# Altium project TestBoard.PrjPcb
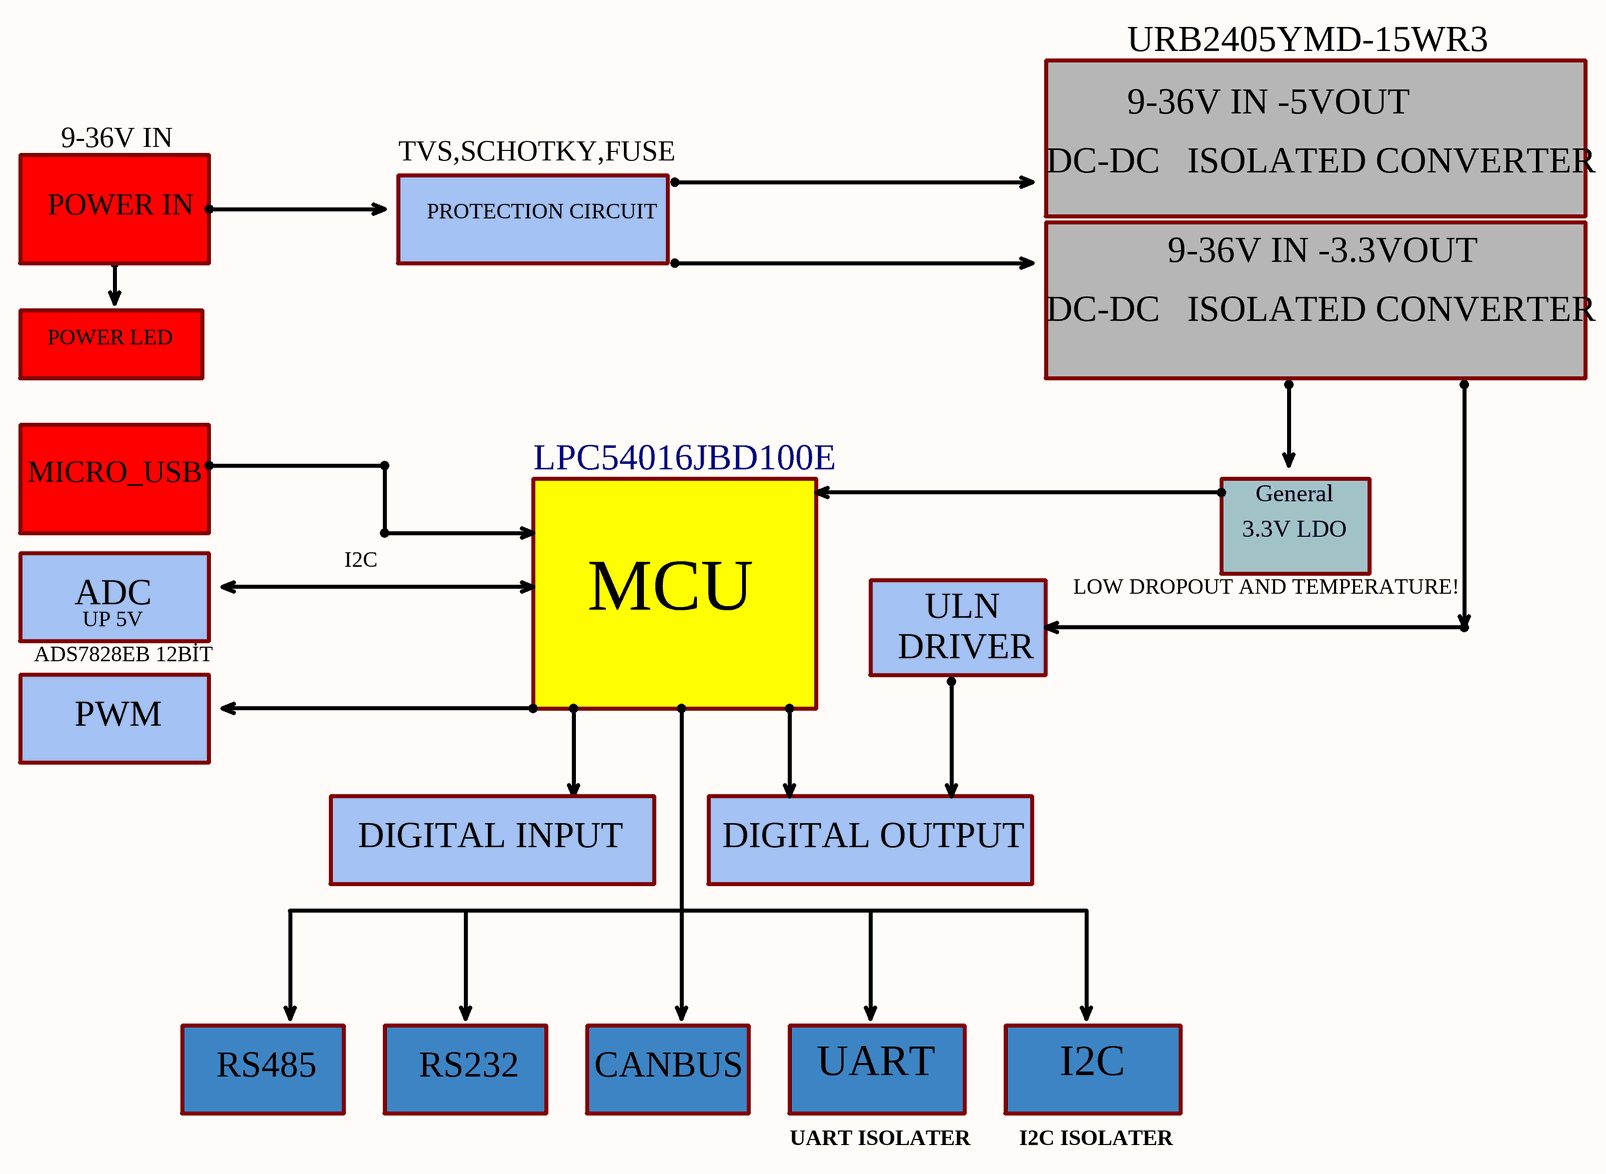
[diagram p0: Blockdiagram.SchDoc]
4 sheets, 61 parts. Net scope: flat (ports and power ports of the same name join across sheets).
Sheets:
  Blockdiagram.SchDoc
  CPU.SchDoc
  communication.SchDoc
  USER_IO.SchDoc

## Sheet Blockdiagram.SchDoc
size A3

### Notes on the sheet
- URB2405YMD-15WR3
- 9-36V IN
- 9-36V IN -5VOUT
- POWER IN
- TVS,SCHOTKY,FUSE
- PROTECTION CIRCUIT
- DC-DC   ISOLATED CONVERTER
- 9-36V IN -3.3VOUT
- POWER LED
- MICRO_USB
- LPC54016JBD100E
- 3.3V LDO
- General
- ADC
- UP 5V
- I2C
- MCU
- ULN
- LOW DROPOUT AND TEMPERATURE!
- ADS7828EB 12BİT
- DRIVER
- PWM
- DIGITAL INPUT
- DIGITAL OUTPUT
- RS485
- RS232
- CANBUS
- UART
- UART ISOLATER
- I2C ISOLATER

## Sheet CPU.SchDoc
size A3
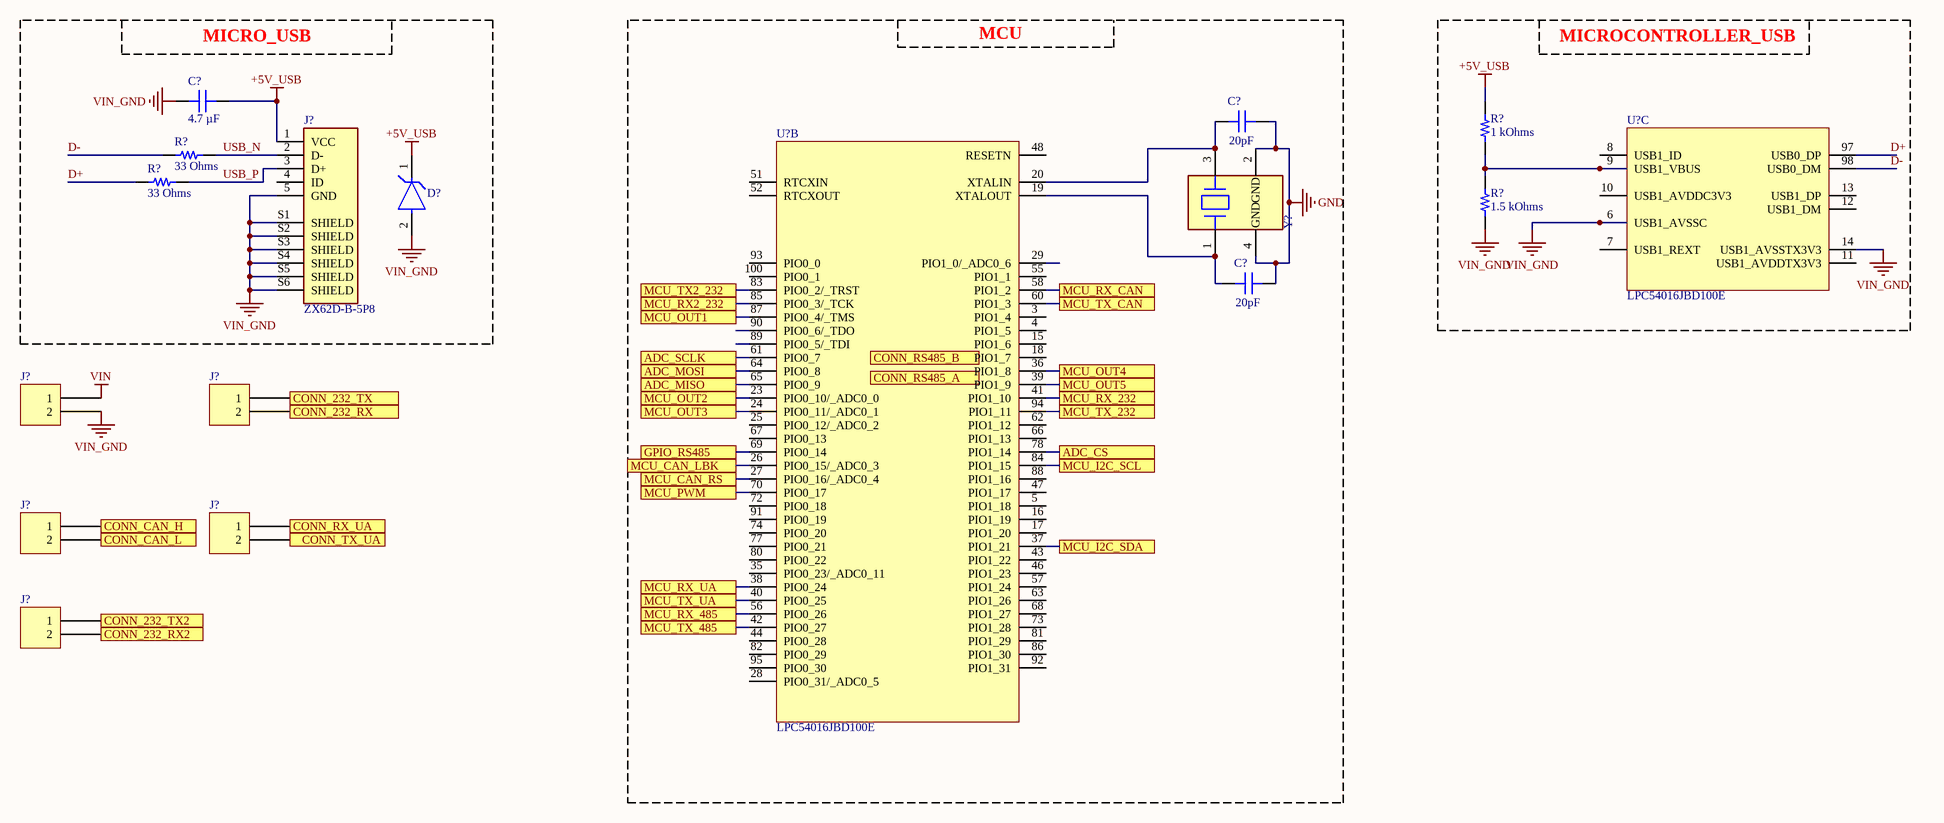
[diagram p1: CPU.SchDoc]

### Parts
(Parts that share a designator on the sheet are numbered #1, #2 ... from top to bottom, then left to right.)
C?#1  4.7 µF  [CAP 0603_1608]
C?#2  20pF  [CAP 0603_1608]
C?#3  20pF  [CAP 0603_1608]
D?  ESDA7P60-1U1M  [TVS-1610]  (value not drawn)
J?#1  ZX62D-B-5P8  [HRS_ZX62D-B-5P8]
J?#2  282834-2  [TE 282834-2]  (value not drawn)
J?#3  282834-2  [TE 282834-2]  (value not drawn)
J?#4  282834-2  [TE 282834-2]  (value not drawn)
J?#5  282834-2  [TE 282834-2]  (value not drawn)
J?#6  282834-2  [TE 282834-2]  (value not drawn)
R?#1  1 kOhms  [RES 0603_1608]
R?#2  33 Ohms  [RES 0603_1608]
R?#3  33 Ohms  [RES 0603_1608]
R?#4  1.5 kOhms  [RES 0603_1608]
U?#1  LPC54016JBD100E  [LQFP-100]  (part C of 3)
U?#2  LPC54016JBD100E  [LQFP-100]  (part B of 3)
Y?  8Z-12.000MAAJ-T  [TXC_8Z_MFG]  (value not drawn)

### Blocks framed on the sheet
MICRO_USB: C?#1 D? J?#1 R?#2 R?#3
MCU: C?#2 C?#3 U?#2 Y?
MICROCONTROLLER_USB: R?#1 R?#4 U?#1

### Ports
ADC_CS, ADC_MISO, ADC_MOSI, ADC_SCLK, CONN_232_RX, CONN_232_RX2, CONN_232_TX, CONN_232_TX2, CONN_CAN_H, CONN_CAN_L, CONN_RS485_A, CONN_RS485_B, CONN_RX_UA, CONN_TX_UA, GPIO_RS485, MCU_CAN_LBK, MCU_CAN_RS, MCU_I2C_SCL, MCU_I2C_SDA, MCU_OUT1, MCU_OUT2, MCU_OUT3, MCU_OUT4, MCU_OUT5, MCU_PWM, MCU_RX2_232, MCU_RX_232, MCU_RX_485, MCU_RX_CAN, MCU_RX_UA, MCU_TX2_232, MCU_TX_232, MCU_TX_485, MCU_TX_CAN, MCU_TX_UA

### Nets
+5V_USB: C?#1.2 D?.1(C) J?#1.1(VCC) R?#1.2
GND: C?#2.2 C?#3.2 Y?.2(GND) Y?.4(GND)
VIN: J?#2.1
VIN_GND: C?#1.1 D?.2(A) J?#1.5(GND) J?#1.S1(SHIELD) J?#1.S2(SHIELD) J?#1.S3(SHIELD) J?#1.S4(SHIELD) J?#1.S5(SHIELD) J?#1.S6(SHIELD) J?#2.2 R?#4.1 U?#1.6(USB1_AVSSC) U?#1.14(USB1_AVSSTX3V3)
CAN_H: J?#4.1 ; port CONN_CAN_H
CAN_L: J?#4.2 ; port CONN_CAN_L
CONN_RX_UA: J?#5.1 ; port CONN_RX_UA
CONN_TX_UA: J?#5.2 ; port CONN_TX_UA
D+: R?#3.1 U?#1.97(USB0_DP)
D-: R?#2.1 U?#1.98(USB0_DM)
GPIO_RS485: U?#2.69(PIO0_14) ; port GPIO_RS485
MCU_I2C_SCL: U?#2.84(PIO1_15) ; port MCU_I2C_SCL
MCU_I2C_SDA: U?#2.37(PIO1_21) ; port MCU_I2C_SDA
MCU_RX_485: U?#2.56(PIO0_26) ; port MCU_RX_485
MCU_RX_CAN: U?#2.58(PIO1_2) ; port MCU_RX_CAN
MCU_RX_UA: U?#2.38(PIO0_24) ; port MCU_RX_UA
MCU_TX_485: U?#2.42(PIO0_27) ; port MCU_TX_485
MCU_TX_CAN: U?#2.60(PIO1_3) ; port MCU_TX_CAN
MCU_TX_UA: U?#2.40(PIO0_25) ; port MCU_TX_UA
USB_N: J?#1.2(D-) R?#2.2
USB_P: J?#1.3(D+) R?#3.2
NetC?#2_1: C?#2.1 U?#2.20(XTALIN) Y?.3
NetC?#3_1: C?#3.1 U?#2.19(XTALOUT) Y?.1
NetJ?#3_1: J?#3.1 ; port CONN_232_TX
NetJ?#3_2: J?#3.2 ; port CONN_232_RX
NetJ?#6_1: J?#6.1 ; port CONN_232_TX2
NetJ?#6_2: J?#6.2 ; port CONN_232_RX2
NetQ?#1_1: U?#2.26(PIO0_15/_ADC0_3) ; port MCU_CAN_LBK
NetQ?#2_1: U?#2.27(PIO0_16/_ADC0_4) ; port MCU_CAN_RS
NetR?#1_1: R?#1.1 R?#4.2 U?#1.9(USB1_VBUS)
NetU?#2_23: U?#2.23(PIO0_10/_ADC0_0) ; port MCU_OUT2
NetU?#2_24: U?#2.24(PIO0_11/_ADC0_1) ; port MCU_OUT3
NetU?#2_36: U?#2.36(PIO1_8) ; port MCU_OUT4
NetU?#2_39: U?#2.39(PIO1_9) ; port MCU_OUT5
NetU?#2_41: U?#2.41(PIO1_10) ; port MCU_RX_232
NetU?#2_61: U?#2.61(PIO0_7) ; port ADC_SCLK
NetU?#2_64: U?#2.64(PIO0_8) ; port ADC_MOSI
NetU?#2_65: U?#2.65(PIO0_9) ; port ADC_MISO
NetU?#2_70: U?#2.70(PIO0_17) ; port MCU_PWM
NetU?#2_78: U?#2.78(PIO1_14) ; port ADC_CS
NetU?#2_83: U?#2.83(PIO0_2/_TRST) ; port MCU_TX2_232
NetU?#2_85: U?#2.85(PIO0_3/_TCK) ; port MCU_RX2_232
NetU?#2_87: U?#2.87(PIO0_4/_TMS) ; port MCU_OUT1
NetU?#2_94: U?#2.94(PIO1_11) ; port MCU_TX_232

Not connected (* = marked no-connect by the designer): J?#1 4(ID); U?#1 7(USB1_REXT) 8(USB1_ID) 10(USB1_AVDDC3V3) 11(USB1_AVDDTX3V3) 12(USB1_DM) 13(USB1_DP); U?#2 3(PIO1_4) 4(PIO1_5) 5(PIO1_18) 15(PIO1_6) 16(PIO1_19) 17(PIO1_20) 18(PIO1_7) 25(PIO0_12/_ADC0_2) 28(PIO0_31/_ADC0_5) 29(PIO1_0/_ADC0_6) 35(PIO0_23/_ADC0_11) 43(PIO1_22) 44(PIO0_28) 46(PIO1_23) 47(PIO1_17) 48(RESETN) 51(RTCXIN) 52(RTCXOUT) 55(PIO1_1) 57(PIO1_24) 62(PIO1_12) 63(PIO1_26) 66(PIO1_13) 67(PIO0_13) 68(PIO1_27) 72(PIO0_18) 73(PIO1_28) 74(PIO0_20) 77(PIO0_21) 80(PIO0_22) 81(PIO1_29) 82(PIO0_29) 86(PIO1_30) 88(PIO1_16) 89(PIO0_5/_TDI) 90(PIO0_6/_TDO) 91(PIO0_19) 92(PIO1_31) 93(PIO0_0) 95(PIO0_30) 100(PIO0_1)

### Library data of the parts
C?#1 = CL10A475KP8NNNC: CAP CER 4.7UF 10V X5R 0603; manufacturer: Samsung Electro-Mechanics; Tolerance: ±10%; Part Number: CL10A475KP8NNNC; Value: 4.7 µF; Applications: General Purpose; Capacitance: 4.7 µF; componentlink1description: Datasheet; componentlink1url: http://www.samsungsem.com/kr/support/product-search/mlcc/CL10A475KP8NNNC.jsp; componentlink2description: DigiKey Link; componentlink2url: https://www.digikey.com/en/products/detail/samsung-electro-mechanics/CL10A475KP8NNNC/3886702; Device Package: 0603 (1608 Metric); lastupdated: 12.04.2022 22:08:21; Lifecycle Status: Active; Minimum Order: 1; Mounting Type: Surface Mount, MLCC; Operating Temperature: -55°C ~ 85°C; Package / Case: 0603 (1608 Metric); packaging: TapeAndReel; partid: 5671; Part Status: Active; price: 0.01; series: CL; Size / Dimension: 0.063" L x 0.031" W (1.60mm x 0.80mm); Supplier 1: DigiKey; Supplier Part Number 1: 1276-1044-1-ND; Temperature Coefficient: X5R; Thickness (Max): 0.035" (0.90mm); Voltage - Rated: 10V
C?#2 C?#3 = 06035A200JAT2A: CAP CER 20PF 50V C0G/NP0 0603; manufacturer: AVX Corporation; Temperature Coefficient: C0G, NP0; Tolerance: ±5%; Part Number: 06035A200JAT2A; Value: 20pF; Applications: General Purpose; Capacitance: 20pF; componentlink1description: Datasheet; componentlink1url: http://datasheets.avx.com/C0GNP0-Dielectric.pdf; componentlink2description: DigiKey Link; componentlink2url: http://digikey.com/product-detail/en/avx-corporation/06035A200JAT2A/478-7912-1-ND/3881535; Device Package: 0603 (1608 Metric); lastupdated: 2.09.2020 01:03:27; Lifecycle Status: Active; Minimum Order: 1; Mounting Type: Surface Mount, MLCC; Operating Temperature: -55°C ~ 125°C; Package / Case: 0603 (1608 Metric); packaging: TapeAndReel; partid: 7153; Part Status: Active; price: 0.04; series: -; Size / Dimension: 0.063" L x 0.032" W (1.60mm x 0.81mm); Supplier 1: DigiKey; Supplier Part Number 1: 478-7912-1-ND; Thickness (Max): 0.035" (0.90mm); Voltage - Rated: 50V
D? = ESDA7P60-1U1M: ESDA Series 6.4 V 700 W SMT Uni-Directional TVS Diode - 1610; Manufacturer: STMicroelectronics; Number of Unidirectional Channels: 1; Reverse Standoff Voltage: 5V; Min Breakdown Voltage: 6.4V; Clamping Voltage: 11.6V; Peak Pulse Power: 700W; Power Line Protection: No; Polarity: Unidirectional; Max Breakdown Voltage: 7.2V; Peak Pulse Current: 60A; Supplier 1: Digi-Key; Manufacturer Part Number: ESDA7P60-1U1M; RoHS: Yes; Category: TVS Diodes; Stock 1: 12994; Pricing 1: 1=0,51000, 10=0,38400, 100=0,23910, 500=0,16360, 1000=0,12584, 2000=0,11326 (USD); Mount: Surface Mount; Case/Package: 1610; Number of Pins: 2; Min Operating Temperature: -55°C; Max Operating Temperature: 150°C; Packaging: Cut Tape; Resistor Type: Zener; REACH SVHC: No SVHC; RoHS Compliant: Yes; ComponentLink1URL: http://www.farnell.com/datasheets/2041290.pdf?src-supplier=Farnell; ComponentLink1Description: http://www.farnell.com/datasheets/2041290.pdf?src-supplier=Farnell; ComponentLink2URL: http://www.st.com/content/ccc/resource/technical/document/datasheet/44/e9/26/44/42/ee/4f/e5/DM00139972.pdf/files/DM00139972.pdf/jcr:content/translations/en.DM00139972.pdf?src-supplier=Digi-Key; ComponentLink2Description: http://www.st.com/content/ccc/resource/technical/document/datasheet/44/e9/26/44/42/ee/4f/e5/DM00139972.pdf/files/DM00139972.pdf/jcr:content/translations/en.DM00139972.pdf?src-supplier=Digi-Key; ComponentLink3URL: http://www.farnell.com/datasheets/2041290.pdf?src-supplier=Element14; ComponentLink3Description: http://www.farnell.com/datasheets/2041290.pdf?src-supplier=Element14; Supplier Part Number 1: 497-16253-1-ND
J?#1 = ZX62D-B-5P8: Conn Micro USB 2.0 Type B RCP 5 POS 0.65mm Solder RA SMD 5 Terminal 1 Port Embossed T/R; MF: Hirose; Value: *; Availability: Unavailable; SnapEDA_Link: https://www.snapeda.com/parts/ZX62D-B-5P8/Hirose%20Electric%20Co%20Ltd/view-part/46842/?ref=snap; Package: FakePackage u; MP: ZX62D-B-5P8; Price: None
J?#2-J?#6 = 282834-2: TERM BLK 2P SIDE ENT 2.54MM PCB; Manufacturer: TE Connectivity AMP Connectors; Current: 10A; Mating Orientation: Horizontal with Board; Number of Levels: 1; Pitch: 0.100" (2.54mm); Positions Per Level: 2; Voltage: 150V; Wire Gauge: 16-30 AWG; Wire Termination: Screw - Rising Cage Clamp; Part Number: 282834-2; Color: Green; ComponentLink1Description: Datasheet; ComponentLink1URL: https://www.te.com/commerce/DocumentDelivery/DDEController?Action=srchrtrv&DocNm=282834&DocType=Customer+Drawing&DocLang=English; ComponentLink2Description: DigiKey Link; ComponentLink2URL: http://digikey.com/product-detail/en/te-connectivity-amp-connectors/282834-2/A98333-ND/1150135; LastUpdated: 15.01.2020 04:15:38; Lifecycle Status: Active; Minimum Order: 1; Mounting Type: Through Hole; Packaging: Bulk; Part Status: Active; Price: 0.88; Series: Buchanan; Supplier 1: DigiKey; Supplier Part Number 1: A98333-ND
R?#1 = TNPU06031K00BZEA00: RES 1 KOHM 0.1% 1/10W 0603; Manufacturer: Vishay Dale; Power (Watts): 0.1W, 1/10W; Temperature Coefficient: ±5ppm/°C; Part Number: TNPU06031K00BZEA00; Value: 1 kOhms; ComponentLink1Description: Datasheet; ComponentLink1URL: http://www.vishay.com/docs/28779/tnpue3.pdf; ComponentLink2Description: DigiKey Link; ComponentLink2URL: https://www.digikey.com/en/products/detail/vishay-dale/TNPU06031K00BZEA00/9448843; Composition: Thin Film; Device Package: 0603 (1608 Metric); Features: Anti-Sulfur, Automotive AEC-Q200, Moisture Resistant; Height - Seated (Max): 0.022" (0.55mm); LastUpdated: 12.04.2022 22:27:30; Lifecycle Status: Active; Minimum Order: 1; Number of Terminations: 2; Operating Temperature: -55°C ~ 125°C; Package / Case: 0603 (1608 Metric); Packaging: TapeAndReel; PartId: 11509; Part Status: Active; Price: 0.77; Ratings: AEC-Q200; Resistance: 1 kOhms; Series: TNPU e3; Size / Dimension: 0.063" L x 0.033" W (1.60mm x 0.85mm); Supplier 1: DigiKey; Supplier Part Number 1: 541-4650-1-ND; Supplier Device Package: 0603; Tolerance: ±0.1%
R?#2 R?#3 = CRGP0603F33R: RES 33 OHM 1% 1/4W 0603; Manufacturer: TE Connectivity Passive Product; Power (Watts): 0.25W, 1/4W; Temperature Coefficient: ±200ppm/°C; Part Number: CRGP0603F33R; Value: 33 Ohms; ComponentLink1Description: Datasheet; ComponentLink1URL: https://www.te.com/commerce/DocumentDelivery/DDEController?Action=srchrtrv&DocNm=9-1773463-9&DocType=DS&DocLang=English; ComponentLink2Description: DigiKey Link; ComponentLink2URL: https://www.digikey.com/en/products/detail/te-connectivity-passive-product/CRGP0603F33R/8577000; Composition: Thick Film; Device Package: 0603 (1608 Metric); Features: Pulse Withstanding; Height - Seated (Max): 0.022" (0.55mm); LastUpdated: 12.04.2022 22:26:54; Lifecycle Status: Active; Minimum Order: 1; Number of Terminations: 2; Operating Temperature: -55°C ~ 155°C; Package / Case: 0603 (1608 Metric); Packaging: TapeAndReel; PartId: 20893; Part Status: Active; Price: 0.02; Resistance: 33 Ohms; Series: CRGP; Size / Dimension: 0.063" L x 0.031" W (1.60mm x 0.80mm); Supplier 1: DigiKey; Supplier Part Number 1: A130398CT-ND; Supplier Device Package: 0603; Tolerance: ±1%
R?#4 = CRGP0603F1K5: RES 1.5K OHM 1% 1/4W 0603; Manufacturer: TE Connectivity Passive Product; Power (Watts): 0.25W, 1/4W; Temperature Coefficient: ±100ppm/°C; Part Number: CRGP0603F1K5; Value: 1.5 kOhms; ComponentLink1Description: Datasheet; ComponentLink1URL: https://www.te.com/commerce/DocumentDelivery/DDEController?Action=srchrtrv&DocNm=9-1773463-9&DocType=DS&DocLang=English; ComponentLink2Description: DigiKey Link; ComponentLink2URL: https://www.digikey.com/en/products/detail/te-connectivity-passive-product/CRGP0603F1K5/8577020; Composition: Thick Film; Device Package: 0603 (1608 Metric); Features: Pulse Withstanding; Height - Seated (Max): 0.022" (0.55mm); LastUpdated: 12.04.2022 22:27:55; Lifecycle Status: Active; Minimum Order: 1; Number of Terminations: 2; Operating Temperature: -55°C ~ 155°C; Package / Case: 0603 (1608 Metric); Packaging: TapeAndReel; PartId: 5000; Part Status: Active; Price: 0.02; Resistance: 1.5 kOhms; Series: CRGP; Size / Dimension: 0.063" L x 0.031" W (1.60mm x 0.80mm); Supplier 1: DigiKey; Supplier Part Number 1: A130418CT-ND; Supplier Device Package: 0603; Tolerance: ±1%
U?#1 U?#2 = LPC54016JBD100E: MCU 32-Bit LPC54016 ARM Cortex-M4 RISC ROM Less 1.71V to 3.6V 100-Pin LQFP Tray; Manufacturer: NXP Semiconductors; Supplier 1: Digi-Key; Manufacturer Part Number: LPC54016JBD100E; RoHS: No; Category: Microcontrollers; Stock 1: 1; Pricing 1: 1=11,88000 (USD); Supplier Part Number 1: 568-13835-ND
Y? = 8Z-12.000MAAJ-T: CRYSTAL 12.0000MHZ 18PF SMD; Manufacturer: TXC; Frequency: 12MHz; Frequency Tolerance: 30ppm; ESR (Equivalent Series Resistance): 150R; Supplier 1: Digi-Key; Manufacturer Part Number: 8Z-12.000MAAJ-T; RoHS: Yes; Category: Crystals; Stock 1: 83431; Pricing 1: 1=1,18000, 10=1,04500, 50=0,97720, 100=0,86360, 500=0,81810, 1000=0,68175 (USD); Mount: Surface Mount; Case/Package: SMD/SMT; Number of Pins: 4; Min Operating Temperature: -20°C; Max Operating Temperature: 70°C; Package Quantity: 1; Load Capacitance: 18pF; Packaging: Tape and Reel; Tolerance: 30ppm; Frequency Stability: 30ppm; Termination: SMD/SMT; Series: 8Z; Length: 2.5mm; Width: 0.079inch; Height: 0.022inch; Depth: 2mm; REACH SVHC: No SVHC; RoHS Compliant: Yes; ComponentLink1URL: https://datasheet.ciiva.com/28498/1838674-28498900.pdf?src-supplier=Element14; ComponentLink1Description: https://datasheet.ciiva.com/28498/1838674-28498900.pdf?src-supplier=Element14; ComponentLink2URL: https://datasheet.ciiva.com/4950/8z-12784-4950167.pdf?src-supplier=Mouser; ComponentLink2Description: https://datasheet.ciiva.com/4950/8z-12784-4950167.pdf?src-supplier=Mouser; ComponentLink3URL: https://datasheet.ciiva.com/8047/1041872-8047871.pdf?src-supplier=Element14; ComponentLink3Description: https://datasheet.ciiva.com/8047/1041872-8047871.pdf?src-supplier=Element14; ComponentLink4URL: https://datasheet.ciiva.com/859/8z-859072.pdf?src-supplier=Digi-Key; ComponentLink4Description: https://datasheet.ciiva.com/859/8z-859072.pdf?src-supplier=Digi-Key; ComponentLink5URL: https://datasheet.ciiva.com/859/8z-859071.pdf?src-supplier=Digi-Key; ComponentLink5Description: https://datasheet.ciiva.com/859/8z-859071.pdf?src-supplier=Digi-Key; ComponentLink6URL: https://datasheet.ciiva.com/859/8z-859073.pdf?src-supplier=Digi-Key; ComponentLink6Description: https://datasheet.ciiva.com/859/8z-859073.pdf?src-supplier=Digi-Key; Supplier Part Number 1: 887-1487-1-ND

## Sheet communication.SchDoc
size A3
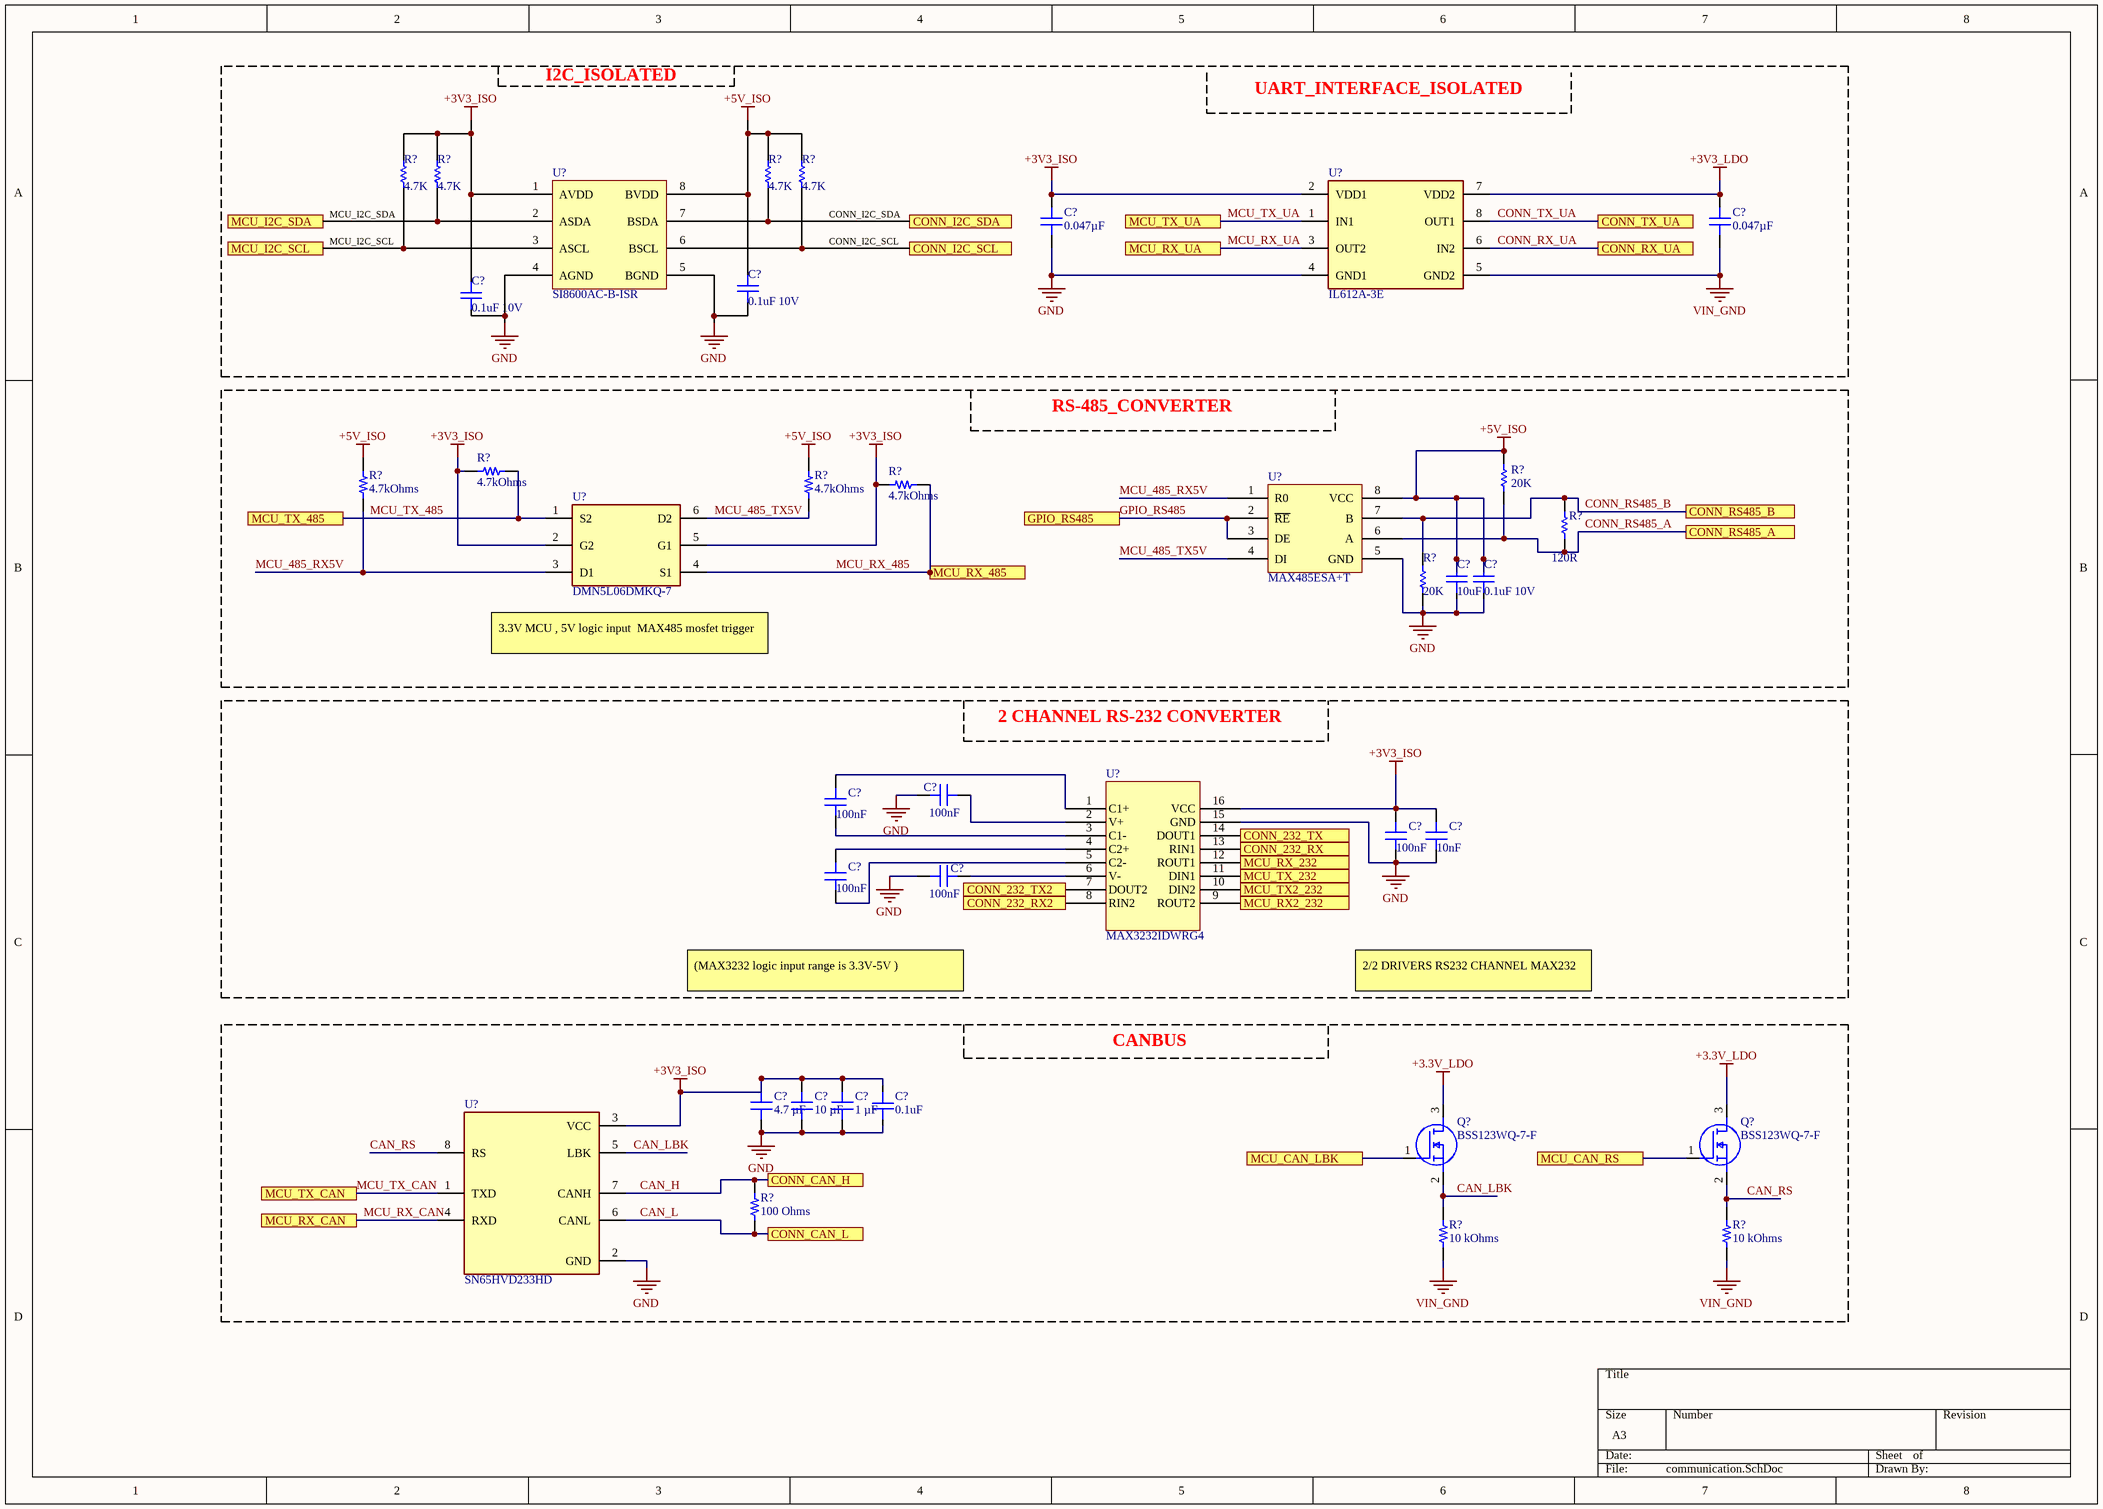
[diagram p2: communication.SchDoc]

### Parts
(Parts that share a designator on the sheet are numbered #1, #2 ... from top to bottom, then left to right.)
C?#4  0.047µF  [CAP 0603_1608]
C?#5  0.047µF  [CAP 0603_1608]
C?#6  0.1uF 10V  [C0603]
C?#7  0.1uF 10V  [C0603]
C?#8  10uF  [C1210]
C?#9  0.1uF 10V  [C0603]
C?#10  100nF  [CAP-0603]
C?#11  100nF  [CAP-0603]
C?#12  100nF  [CAP-0603]
C?#13  100nF  [CAP-0603]
C?#14  10nF  [CAP-0603]
C?#15  100nF  [CAP-0603]
C?#16  0.1uF  [C0603]
C?#17  4.7 µF  [CAP 0603_1608]
C?#18  10 µF  [CAP 0603_1608]
C?#19  1 µF  [CAP 0603_1608]
Q?#1  BSS123WQ-7-F  [SOT65P210X110-3N]
Q?#2  BSS123WQ-7-F  [SOT65P210X110-3N]
R?#5  4.7K  [R0805]
R?#6  4.7K  [R0805]
R?#7  4.7K  [R0805]
R?#8  4.7K  [R0805]
R?#9  4.7kOhms  [RES-0603]
R?#10  4.7kOhms  [RES-0603]
R?#11  20K  [R0805]
R?#12  4.7kOhms  [RES-0603]
R?#13  4.7kOhms  [RES-0603]
R?#14  120R  [R0805]
R?#15  20K  [R0805]
R?#16  100 Ohms  [RES 0603_1608]
R?#17  10 kOhms  [RES 0603_1608]
R?#18  10 kOhms  [RES 0603_1608]
U?#3  SI8600AC-B-ISR  [SOIC127P600X175-8N]
U?#4  IL612A-3E  [8-soic]
U?#5  MAX485ESA+T  [SOIC127P600X175-8N]
U?#6  DMN5L06DMKQ-7  [SOT-26]
U?#7  MAX3232IDWRG4  [SOIC-16]
U?#8  SN65HVD233HD  [8-soic]

### Blocks framed on the sheet
RS-485_CONVERTER: C?#8 C?#9 R?#9-R?#15 U?#5 U?#6
2 CHANNEL RS-232 CONVERTER: C?#10-C?#15 U?#7
CANBUS: C?#16-C?#19 Q?#1 Q?#2 R?#16-R?#18 U?#8

### Ports
CONN_232_RX, CONN_232_RX2, CONN_232_TX, CONN_232_TX2, CONN_CAN_H, CONN_CAN_L, CONN_I2C_SCL, CONN_I2C_SDA, CONN_RS485_A, CONN_RS485_B, CONN_RX_UA, CONN_TX_UA, GPIO_RS485, MCU_CAN_LBK, MCU_CAN_RS, MCU_I2C_SCL, MCU_I2C_SDA, MCU_RX2_232, MCU_RX_232, MCU_RX_485, MCU_RX_CAN, MCU_RX_UA, MCU_TX2_232, MCU_TX_232, MCU_TX_485, MCU_TX_CAN, MCU_TX_UA

### Nets
+3.3V_LDO: Q?#1.3(D) Q?#2.3(D)
+3V3_ISO: C?#4.2 C?#7.2 C?#13.2 C?#14.2 C?#16.1 C?#17.2 C?#18.2 C?#19.2 R?#5.2 R?#6.2 R?#9.2 R?#10.1 U?#3.1(AVDD) U?#4.2(VDD1) U?#6.2(G2) U?#6.5(G1) U?#7.16(VCC) U?#8.3(VCC)
+3V3_LDO: C?#5.2 U?#4.7(VDD2)
+5V_ISO: C?#6.2 C?#8.2 C?#9.2 R?#7.2 R?#8.2 R?#11.2 R?#12.2 R?#13.2 U?#3.8(BVDD) U?#5.8(VCC)
GND: C?#4.1 C?#6.1 C?#7.1 C?#8.1 C?#9.1 C?#11.2 C?#13.1 C?#14.1 C?#15.2 C?#16.2 C?#17.1 C?#18.1 C?#19.1 R?#15.1 U?#3.4(AGND) U?#3.5(BGND) U?#4.4(GND1) U?#5.5(GND) U?#7.15(GND) U?#8.2(GND)
VIN_GND: C?#5.1 R?#17.1 R?#18.1 U?#4.5(GND2)
CAN_H: R?#16.2 U?#8.7(CANH) ; port CONN_CAN_H
CAN_L: R?#16.1 U?#8.6(CANL) ; port CONN_CAN_L
CAN_LBK: Q?#1.2(S) R?#17.2 U?#8.5(LBK)
CAN_RS: Q?#2.2(S) R?#18.2 U?#8.8(RS)
CONN_I2C_SCL: R?#8.1 U?#3.6(BSCL) ; port CONN_I2C_SCL
CONN_I2C_SDA: R?#7.1 U?#3.7(BSDA) ; port CONN_I2C_SDA
CONN_RS485_A: R?#11.1 R?#14.1 U?#5.6(A) ; port CONN_RS485_A
CONN_RS485_B: R?#14.2 R?#15.2 U?#5.7(B) ; port CONN_RS485_B
CONN_RX_UA: U?#4.6(IN2) ; port CONN_RX_UA
CONN_TX_UA: U?#4.8(OUT1) ; port CONN_TX_UA
GPIO_RS485: U?#5.2(~{RE}) U?#5.3(DE) ; port GPIO_RS485
MCU_485_RX5V: R?#12.1 U?#5.1(R0) U?#6.3(D1)
MCU_485_TX5V: R?#13.1 U?#5.4(DI) U?#6.6(D2)
MCU_I2C_SCL: R?#5.1 U?#3.3(ASCL) ; port MCU_I2C_SCL
MCU_I2C_SDA: R?#6.1 U?#3.2(ASDA) ; port MCU_I2C_SDA
MCU_RX_485: R?#10.2 U?#6.4(S1) ; port MCU_RX_485
MCU_RX_CAN: U?#8.4(RXD) ; port MCU_RX_CAN
MCU_RX_UA: U?#4.3(OUT2) ; port MCU_RX_UA
MCU_TX_485: R?#9.1 U?#6.1(S2) ; port MCU_TX_485
MCU_TX_CAN: U?#8.1(TXD) ; port MCU_TX_CAN
MCU_TX_UA: U?#4.1(IN1) ; port MCU_TX_UA
NetC?#10_1: C?#10.1 U?#7.1(C1+)
NetC?#10_2: C?#10.2 U?#7.3(C1-)
NetC?#11_1: C?#11.1 U?#7.2(V+)
NetC?#12_1: C?#12.1 U?#7.4(C2+)
NetC?#12_2: C?#12.2 U?#7.5(C2-)
NetC?#15_1: C?#15.1 U?#7.6(V-)
NetJ?#3_1: U?#7.14(DOUT1) ; port CONN_232_TX
NetJ?#3_2: U?#7.13(RIN1) ; port CONN_232_RX
NetJ?#6_1: U?#7.7(DOUT2) ; port CONN_232_TX2
NetJ?#6_2: U?#7.8(RIN2) ; port CONN_232_RX2
NetQ?#1_1: Q?#1.1(G) ; port MCU_CAN_LBK
NetQ?#2_1: Q?#2.1(G) ; port MCU_CAN_RS
NetU?#2_41: U?#7.12(ROUT1) ; port MCU_RX_232
NetU?#2_83: U?#7.10(DIN2) ; port MCU_TX2_232
NetU?#2_85: U?#7.9(ROUT2) ; port MCU_RX2_232
NetU?#2_94: U?#7.11(DIN1) ; port MCU_TX_232

### Notes on the sheet
- I2C_ISOLATED
- UART_INTERFACE_ISOLATED
- (near U?#6) 3.3V MCU , 5V logic input  MAX485 mosfet trigger
- (MAX3232 logic input range is 3.3V-5V )
- 2/2 DRIVERS RS232 CHANNEL MAX232

### Library data of the parts
C?#4 C?#5 = 0603YC473KAT2A: CAP CER 0.047UF 16V X7R 0603; manufacturer: AVX Corporation; Tolerance: ±10%; Part Number: 0603YC473KAT2A; Value: 0.047µF; Applications: General Purpose; Capacitance: 0.047µF; componentlink1description: Datasheet; componentlink1url: http://datasheets.avx.com/X7RDielectric.pdf; componentlink2description: DigiKey Link; componentlink2url: http://digikey.com/product-detail/en/avx-corporation/0603YC473KAT2A/478-5894-1-ND/2177826; Device Package: 0603 (1608 Metric); lastupdated: 2.09.2020 01:03:32; Lifecycle Status: Active; Minimum Order: 1; Mounting Type: Surface Mount, MLCC; Operating Temperature: -55°C ~ 125°C; Package / Case: 0603 (1608 Metric); packaging: TapeAndReel; partid: 4239; Part Status: Active; price: 0.02; series: -; Size / Dimension: 0.063" L x 0.032" W (1.60mm x 0.81mm); Supplier 1: DigiKey; Supplier Part Number 1: 478-5894-1-ND; Temperature Coefficient: X7R; Thickness (Max): 0.035" (0.90mm); Voltage - Rated: 16V
C?#6 C?#7 C?#9 = C0009: CAP CER 0.1UF 10V X7R 0603; Part Number: C0603C104K8RACTU; Manufacturer.: KEMET
C?#8 = C0016: CAP CER 10UF 25V X7R 1210; Part Number: C1210C106K3RACTU; Manufacturer.: KEMET
C?#10-C?#13 C?#15 = C0603C104K5RAC7411: Cap Ceramic 0.1uF 50V X7R 10% SMD 0603 125°C Paper T/R 100nF; Manufacturer: KEMET; Dissipation Factor: 2.5%; Supplier 1: Digi-Key; Manufacturer Part Number: C0603C104K5RAC7411; RoHS: Yes; Category: Ceramic Capacitors; Stock 1: 3300000; Pricing 1: 15000=0,01540, 30000=0,01463, 75000=0,01309, 105000=0,01059, 150000=0,01024, 375000=0,00963 (USD); Mount: Surface Mount; Case/Package: 0603; Case Code (Metric): 1608; Case Code (Imperial): 0603; Dielectric Material: Ceramic; Min Operating Temperature: -55°C; Max Operating Temperature: 125°C; Tolerance: 10%; Capacitance: 100nF; Dielectric: X7R; Voltage Rating (DC): 50V; Packaging: Tape and Reel; Package Quantity: 15000; Voltage Rating: 50V; Termination: SMD/SMT; Length: 1.6mm; Width: 0.031inch; Height: 0.8mm; Thickness: 0.035inch; Lead Pitch: 0.7mm; Depth: 0.8mm; Radiation Hardening: No; ComponentLink1URL: https://datasheet.ciiva.com/5424/kem-c1002-x7r-smd-5424426.pdf?src-supplier=Mouser; ComponentLink1Description: https://datasheet.ciiva.com/5424/kem-c1002-x7r-smd-5424426.pdf?src-supplier=Mouser; Supplier Part Number 1: 399-7374-2-ND
C?#14 = C0603C103M5RAC7411_1: Cap Ceramic 0.01uF 50V X7R 20% SMD 0603 125°C Paper T/R; Manufacturer: KEMET; Supplier 1: Digi-Key; Manufacturer Part Number: C0603C103M5RAC7411; RoHS: Yes; Category: Ceramic Capacitors; Stock 1: 336197; Pricing 1: 1=0,10000, 10=0,03000, 50=0,01640, 100=0,01350, 500=0,00962, 1000=0,00756, 2500=0,00688, 5000=0,00632 (USD); Mount: Surface Mount; Case/Package: 0603; Case Code (Imperial): 0603; Case Code (Metric): 1608; Contact Plating: Tin,Matte; Dielectric Material: Ceramic; Min Operating Temperature: -55°C; Max Operating Temperature: 125°C; Packaging: Tape and Reel; Package Quantity: 50000; Tolerance: 20%; Voltage Rating: 50V; Voltage Rating (DC): 50V; Capacitance: 10nF; Dielectric: X7R; Termination: SMD/SMT; Series: C0603C; Construction: Flat; Length: 1.6mm; Height: 0.8mm; Lead Pitch: 0.7mm; Depth: 0.8mm; Radiation Hardening: No; RoHS Compliant: Yes; ComponentLink1URL: http://www.mouser.com/ds/2/212/KEM_C1002_X7R_SMD-1102033.pdf?src-supplier=Mouser; ComponentLink1Description: http://www.mouser.com/ds/2/212/KEM_C1002_X7R_SMD-1102033.pdf?src-supplier=Mouser; ComponentLink2URL: http://capacitoredge.kemet.com/capedge2/DataSheet?pn=C0603C103M5RAC7411&src-supplier=Avnet; ComponentLink2Description: http://capacitoredge.kemet.com/capedge2/DataSheet?pn=C0603C103M5RAC7411&src-supplier=Avnet; Supplier Part Number 1: 399-C0603C103M5RAC7411CT-ND
C?#16 = C0001: CAP CER 0.1UF 50V X7R 0603; Manufacturer.: KEMET; Part Number: C0603C104K5RACTU
C?#17 = CL10A475KA8NQNC: CAP CER 4.7UF 25V X5R 0603; manufacturer: Samsung Electro-Mechanics; Tolerance: ±10%; Part Number: CL10A475KA8NQNC; Value: 4.7 µF; Applications: General Purpose; Capacitance: 4.7 µF; componentlink1description: Datasheet; componentlink1url: http://www.samsungsem.com/kr/support/product-search/mlcc/CL10A475KA8NQNC.jsp; componentlink2description: DigiKey Link; componentlink2url: https://www.digikey.com/en/products/detail/samsung-electro-mechanics/CL10A475KA8NQNC/3887558; Device Package: 0603 (1608 Metric); lastupdated: 12.05.2022 14:08:21; Lifecycle Status: Active; Minimum Order: 1; Mounting Type: Surface Mount, MLCC; Operating Temperature: -55°C ~ 85°C; Package / Case: 0603 (1608 Metric); packaging: TapeAndReel; partid: 2349; Part Status: Active; price: 0.06; series: CL; Size / Dimension: 0.063" L x 0.031" W (1.60mm x 0.80mm); Supplier 1: DigiKey; Supplier Part Number 1: 1276-1900-1-ND; Temperature Coefficient: X5R; Thickness (Max): 0.035" (0.90mm); Voltage - Rated: 25V
C?#18 = GRT188R61C106ME13D: CAP CER 10UF 16V X5R 0603; manufacturer: Murata Electronics; Tolerance: ±20%; Part Number: GRT188R61C106ME13D; Value: 10 µF; Applications: Automotive; Capacitance: 10 µF; componentlink1description: Datasheet; componentlink1url: https://search.murata.co.jp/Ceramy/image/img/A01X/G101/ENG/GRT188R61C106ME13-01.pdf; componentlink2description: DigiKey Link; componentlink2url: https://www.digikey.com/en/products/detail/murata-electronics/GRT188R61C106ME13D/5416740; Device Package: 0603 (1608 Metric); lastupdated: 12.05.2022 14:08:21; Lifecycle Status: Active; Minimum Order: 1; Mounting Type: Surface Mount, MLCC; Operating Temperature: -55°C ~ 85°C; Package / Case: 0603 (1608 Metric); packaging: TapeAndReel; partid: 2515; Part Status: Active; price: 0.07; Ratings: AEC-Q200; series: GRT; Size / Dimension: 0.063" L x 0.031" W (1.60mm x 0.80mm); Supplier 1: DigiKey; Supplier Part Number 1: 490-12318-1-ND; Temperature Coefficient: X5R; Thickness (Max): 0.035" (0.90mm); Voltage - Rated: 16V
C?#19 = TMK107BJ105MAHT: CAP CER 1UF 25V X5R 0603; manufacturer: Taiyo Yuden; Tolerance: ±20%; Part Number: TMK107BJ105MAHT; Value: 1 µF; Applications: Automotive, SMPS Filtering; Capacitance: 1 µF; componentlink1description: Datasheet; componentlink1url: https://ds.yuden.co.jp/TYCOMPAS/ut/detail?pn=TMK107BJ105MAHT &u=M; componentlink2description: DigiKey Link; componentlink2url: https://www.digikey.com/en/products/detail/taiyo-yuden/TMK107BJ105MAHT/6563148; Device Package: 0603 (1608 Metric); Features: Ultra Low ESR; lastupdated: 12.05.2022 14:08:20; Lifecycle Status: Active; Minimum Order: 1; Mounting Type: Surface Mount, MLCC; Operating Temperature: -55°C ~ 85°C; Package / Case: 0603 (1608 Metric); packaging: TapeAndReel; partid: 2797; Part Status: Active; price: 0.02; Ratings: AEC-Q200; series: M; Size / Dimension: 0.063" L x 0.031" W (1.60mm x 0.80mm); Supplier 1: DigiKey; Supplier Part Number 1: 587-6356-1-ND; Temperature Coefficient: X5R; Thickness (Max): 0.035" (0.90mm); Voltage - Rated: 25V
Q?#1 Q?#2 = BSS123WQ-7-F: MOSFET (N-Channel); Manufacturer_Name: Diodes Inc.; Datasheet Link: https://labcenter.componentsearchengine.com/Datasheets/2/BSS123WQ-7-F.pdf; Height: 1.1mm; Manufacturer_Part_Number: BSS123WQ-7-F; Mouser Part Number: 621-BSS123WQ-7-F; Mouser Price/Stock: https://www.mouser.co.uk/ProductDetail/Diodes-Incorporated/BSS123WQ-7-F?qs=GSeC4G%252BEqEX8zUQUKMJ7Eg%3D%3D; Arrow Part Number: BSS123WQ-7-F; Arrow Price/Stock: https://www.arrow.com/en/products/bss123wq-7-f/diodes-incorporated
R?#5-R?#8 = R0013: RES SMD 4.7K OHM 1% 1/8W 0805; Manufacturer.: Panasonic Electronic Components; Part Number: ERJ-6ENF4701V
R?#9 R?#10 R?#12 R?#13 = RC0603FR-074K7L: 4.7 kOhms ±1% 0.1W, 1/10W Chip Resistor 0603 (1608 Metric) Moisture Resistant Thick Film; Manufacturer: Yageo; Manufacturer Part Number: RC0603FR-0710KL; Resistance: 10kR; Temperature Coefficient: 100ppm/°C; Voltage Rating (DC): 50V; Power Rating: 100mW; Voltage Rating: 75V; Supplier 1: Digi-Key; RoHS: Yes; Category: Chip SMD Resistors; Stock 1: 28996893; Pricing 1: 1=0,10000, 10=0,02400, 100=0,00970, 1000=0,00436, 2500=0,00378 (USD); Case/Package: 0603; Number of Pins: 2; Case Code (Imperial): 0603; Case Code (Metric): 1608; Weight: 7.1E-05oz; Size Code: 0603; Min Operating Temperature: -55°C; Max Operating Temperature: 155°C; Tolerance: 1%; Resistor Type: Thick Film; Packaging: Tape and Reel; Termination: SMD/SMT; Features: Moisture Resistant; Series: RC; Max Power Dissipation: 100mW; Number of Terminations: 2; Resistance Tolerance: 1%; Construction: Rectangular; Length: 1.6mm; Width: 0.8mm; Height: 0.45mm; Depth: 0.8mm; Lead Pitch: 0.3mm; REACH SVHC: Unknown; Lead Free: Lead Free; Military Standard: Not; RoHS Compliant: Yes; ComponentLink1URL: https://datasheet.ciiva.com/7660/38590-7660789.pdf?src-supplier=Element14; ComponentLink1Description: https://datasheet.ciiva.com/7660/38590-7660789.pdf?src-supplier=Element14; ComponentLink2URL: https://datasheet.ciiva.com/7983/443971-7983596.pdf?src-supplier=Element14; ComponentLink2Description: https://datasheet.ciiva.com/7983/443971-7983596.pdf?src-supplier=Element14; ComponentLink3URL: https://datasheet.ciiva.com/22747/443971-22747519.pdf?src-supplier=Element14; ComponentLink3Description: https://datasheet.ciiva.com/22747/443971-22747519.pdf?src-supplier=Element14; ComponentLink4URL: https://datasheet.ciiva.com/46440/1868787-46440891.pdf?src-supplier=Element14; ComponentLink4Description: https://datasheet.ciiva.com/46440/1868787-46440891.pdf?src-supplier=Element14; ComponentLink5URL: https://datasheet.ciiva.com/7746/1738695-7746239.pdf?src-supplier=Element14; ComponentLink5Description: https://datasheet.ciiva.com/7746/1738695-7746239.pdf?src-supplier=Element14; ComponentLink6URL: https://datasheet.ciiva.com/15189/getdatasheetpartid-409289-15189591.pdf?src-supplier=Verical; ComponentLink6Description: https://datasheet.ciiva.com/15189/getdatasheetpartid-409289-15189591.pdf?src-supplier=Verical; Supplier Part Number 1: 311-10.0KHRCT-ND; Supplier 2: Digi-Key; Stock 2: 20570870; Pricing 2: 1=0,10000, 10=0,02400, 100=0,00970, 1000=0,00436, 2500=0,00378 (USD); ComponentLink7URL: https://datasheet.ciiva.com/15189/getdatasheetpartid-422754-15189760.pdf?src-supplier=Verical; ComponentLink7Description: https://datasheet.ciiva.com/15189/getdatasheetpartid-422754-15189760.pdf?src-supplier=Verical; ComponentLink8URL: https://datasheet.ciiva.com/7660/38590-7660794.pdf?src-supplier=Element14; ComponentLink8Description: https://datasheet.ciiva.com/7660/38590-7660794.pdf?src-supplier=Element14; ComponentLink9URL: https://datasheet.ciiva.com/22747/443971-22747528.pdf?src-supplier=Element14; ComponentLink9Description: https://datasheet.ciiva.com/22747/443971-22747528.pdf?src-supplier=Element14; ComponentLink10URL: https://datasheet.ciiva.com/46440/1868787-46440909.pdf?src-supplier=Element14; ComponentLink10Description: https://datasheet.ciiva.com/46440/1868787-46440909.pdf?src-supplier=Element14; ComponentLink11URL: https://datasheet.ciiva.com/7746/1868787-7746365.pdf?src-supplier=Element14; ComponentLink11Description: https://datasheet.ciiva.com/7746/1868787-7746365.pdf?src-supplier=Element14; ComponentLink12URL: https://datasheet.ciiva.com/7746/1738695-7746366.pdf?src-supplier=Element14; ComponentLink12Description: https://datasheet.ciiva.com/7746/1738695-7746366.pdf?src-supplier=Element14; Supplier Part Number 2: 311-4.70KHRCT-ND
R?#11 R?#15 = R0022: RES SMD 20K OHM 1% 1/8W 0805; Part Number: ERJ-6ENF2002V; Manufacturer.: Panasonic Electronic Components
R?#14 = R0014: RES SMD 120 OHM 1% 1/8W 0805; Manufacturer.: Panasonic Electronic Components; Part Number: ERJ-6ENF1200V
R?#16 = PEP0603Y1000BGTA: PEP0603 10PPM/C 100R 0.1% G TA; Manufacturer: Vishay Sfernice; Power (Watts): 0.32W; Temperature Coefficient: ±10ppm/°C; Part Number: PEP0603Y1000BGTA; Value: 100 Ohms; ComponentLink1Description: Datasheet; ComponentLink1URL: https://www.vishay.com/docs/53083/pep.pdf; ComponentLink2Description: DigiKey Link; ComponentLink2URL: https://www.digikey.com/en/products/detail/vishay-sfernice/PEP0603Y1000BGTA/15777713; Composition: Thin Film; Device Package: 0603 (1608 Metric); Features: Anti-Sulfur; Height - Seated (Max): 0.018" (0.45mm); LastUpdated: 12.05.2022 14:25:31; Lifecycle Status: Active; Minimum Order: 1; Number of Terminations: 2; Operating Temperature: -55°C ~ 155°C; Package / Case: 0603 (1608 Metric); Packaging: TapeAndReel; PartId: 62030; Part Status: Active; Price: 5.75; Resistance: 100 Ohms; Series: PEP; Size / Dimension: 0.060" L x 0.033" W (1.52mm x 0.85mm); Supplier 1: DigiKey; Supplier Part Number 1: 716-PEP0603Y1000BGTACT-ND; Supplier Device Package: 0603; Tolerance: ±0.1%
R?#17 R?#18 = RCC060310K0FKEA: RCC0603 100 10K 1% ET1 E3; Manufacturer: Vishay Dale; Power (Watts): 0.2W, 1/5W; Temperature Coefficient: ±100ppm/°C; Part Number: RCC060310K0FKEA; Value: 10 kOhms; ComponentLink1Description: Datasheet; ComponentLink1URL: https://www.vishay.com/docs/20066/rcce3.pdf; ComponentLink2Description: DigiKey Link; ComponentLink2URL: https://www.digikey.com/en/products/detail/vishay-dale/RCC060310K0FKEA/12084233; Composition: Thick Film; Device Package: 0603 (1608 Metric); Features: Automotive AEC-Q200; Height - Seated (Max): 0.020" (0.50mm); LastUpdated: 12.05.2022 14:25:26; Lifecycle Status: Active; Minimum Order: 1; Number of Terminations: 2; Operating Temperature: -55°C ~ 155°C; Package / Case: 0603 (1608 Metric); Packaging: TapeAndReel; PartId: 67022; Part Status: Active; Price: 0.01; Ratings: AEC-Q200; Resistance: 10 kOhms; Series: RCC e3; Size / Dimension: 0.061" L x 0.033" W (1.55mm x 0.85mm); Supplier 1: DigiKey; Supplier Part Number 1: 541-RCC060310K0FKEACT-ND; Supplier Device Package: 0603; Tolerance: ±1%
U?#3 = U0021: Bidirectional I2C Isolators with Unidirectional Digital Channels; Manufacturer.: Skyworks Solutions Inc; Part Number: SI8600AC-B-ISR
U?#4 = IL612A-3E: 2-Channel Passive Input, Open-Drain Isolator, 2.5 kV, SOIC8,; MF: NVE; Purchase-URL: https://pricing.snapeda.com/search/part/IL612A-3E/?ref=eda; Check_prices: https://www.snapeda.com/parts/IL612A-3E/NVE/view-part/?ref=eda; Package: SOIC-8 NVE; SnapEDA_Link: https://www.snapeda.com/parts/IL612A-3E/NVE/view-part/?ref=snap; Value: *; MP: IL612A-3E; Digi-Key_Part_Number: 390-IL612A-3E-ND
U?#5 = U0017: 1/1 Transceiver Half RS422, RS485 8-SOIC; Manufacturer.: Maxim Integrated; Part Number: MAX485ESA+T
U?#6 = DMN5L06DMKQ-7: Transistor MOSFET Array Dual N-CH 50V 305mA 6-Pin SOT-26 T/R; Manufacturer: Diodes; MP: TS19720CX6 RFG; MF: Taiwan Semiconductor; Rds On Max: 2R; Input Capacitance: 50pF; Max Power Dissipation: 400mW; FET Type: 2 N-Channel; Availability: In Stock; Package: SOT-26 Taiwan Semiconductor; Check_prices: https://www.snapeda.com/parts/TS19720CX6%20RFG/Taiwan+Semiconductor/view-part/?ref=eda; Price: None; SnapEDA_Link: https://www.snapeda.com/parts/TS19720CX6%20RFG/Taiwan+Semiconductor/view-part/?ref=snap; Value: *; Purchase-URL: https://pricing.snapeda.com/search/part/TS19720CX6 RFG/?ref=eda; Supplier 1: Digi-Key; Manufacturer Part Number: DMN5L06DMKQ-7; RoHS: Yes; Category: MOSFETs; Stock 1: 50; Pricing 1: 1=0,56000, 10=0,47600, 100=0,35570, 500=0,27952, 1000=0,21598 (USD); Mount: Surface Mount; Case/Package: SOT-23-6; Min Operating Temperature: -65°C; Max Operating Temperature: 150°C; Packaging: Tape and Reel; Drain to Source Voltage (Vdss): 50V; Continuous Drain Current (ID): 305mA; RoHS Compliant: Yes; ComponentLink1URL: http://www.mouser.com/ds/2/115/ds30927-709407.pdf?src-supplier=Mouser; ComponentLink1Description: http://www.mouser.com/ds/2/115/ds30927-709407.pdf?src-supplier=Mouser; ComponentLink2URL: https://www.diodes.com/assets/Datasheets/DMN5L06DMKQ.pdf?src-supplier=Digi-Key; ComponentLink2Description: https://www.diodes.com/assets/Datasheets/DMN5L06DMKQ.pdf?src-supplier=Digi-Key; Supplier Part Number 1: DMN5L06DMKQ-7DICT-ND
U?#7 = MAX3232IDWRG4: IC Transceiver Full 2/2 16SOIC; Manufacturer: Texas Instruments; Nominal Supply Current: 1mA; Data Rate: 250Kbps; Number of Receivers: 2; Max Supply Voltage: 5.5V; Min Supply Voltage: 3V; Logic Function: Transceiver,Receiver; Number of Transceivers: 1; Operating Supply Voltage: 5V; Supplier 1: Digi-Key; Manufacturer Part Number: MAX3232IDWRG4; RoHS: Yes; Category: RS-232 / RS-422 / RS-485 Interface ICs; Pricing 1: 2000=1,32825 (USD); Mount: Surface Mount; Case/Package: SOIC; Number of Pins: 16; Weight: 0.014829oz; Min Operating Temperature: -40°C; Max Operating Temperature: 85°C; Package Quantity: 2000; Packaging: Tape and Reel; Number of Transmitters: 2; Number of Drivers: 2; Series: -; Supply Current: 1mA; Lead Free: Lead Free; RoHS Compliant: Yes; ComponentLink1URL: https://datasheet.ciiva.com/1770/max3232-1770641.pdf?src-supplier=Digi-Key; ComponentLink1Description: https://datasheet.ciiva.com/1770/max3232-1770641.pdf?src-supplier=Digi-Key
U?#8 = SN65HVD233HD: 1/1 Transceiver Half CANbus 8-SOIC; Package: None; Price: None; Value: *; MP: SN65HVD233HD; Availability: Unavailable

## Sheet USER_IO.SchDoc
size A3
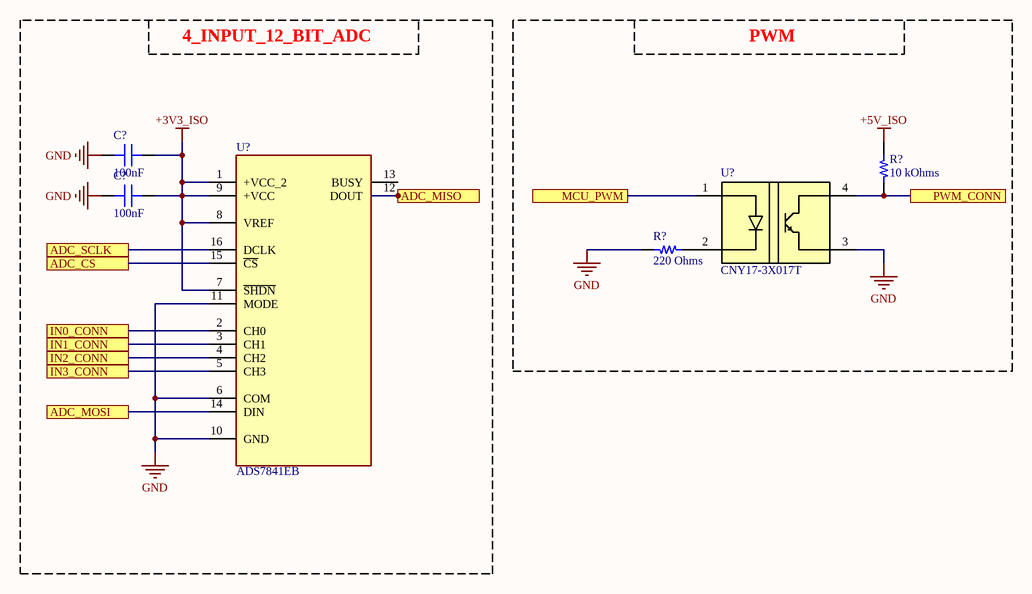
[diagram p3: USER_IO.SchDoc]

### Parts
(Parts that share a designator on the sheet are numbered #1, #2 ... from top to bottom, then left to right.)
C?#20  100nF  [CAP-0603]
C?#21  100nF  [CAP-0603]
R?#19  10 kOhms  [RES 0603_1608]
R?#20  220 Ohms  [RES 0603_1608]
U?#9  ADS7841EB  [SOP63P600X175-16N]
U?#10  CNY17-3X017T  [U0032]

### Blocks framed on the sheet
4_INPUT_12_BIT_ADC: C?#20 C?#21 U?#9
PWM: R?#19 R?#20 U?#10

### Ports
ADC_CS, ADC_MISO, ADC_MOSI, ADC_SCLK, IN0_CONN, IN1_CONN, IN2_CONN, IN3_CONN, MCU_PWM, PWM_CONN

### Nets
+3V3_ISO: C?#20.1 C?#21.1 U?#9.1(+VCC_2) U?#9.7(~{SHDN}) U?#9.8(VREF) U?#9.9(+VCC)
+5V_ISO: R?#19.2
GND: C?#20.2 C?#21.2 R?#20.2 U?#9.6(COM) U?#9.10(GND) U?#9.11(MODE) U?#10.3(E)
NetR?#19_1: R?#19.1 U?#10.4(C) ; port PWM_CONN
NetR?#20_1: R?#20.1 U?#10.2(C)
NetU?#2_61: U?#9.16(DCLK) ; port ADC_SCLK
NetU?#2_64: U?#9.14(DIN) ; port ADC_MOSI
NetU?#2_65: U?#9.12(DOUT) ; port ADC_MISO
NetU?#2_70: U?#10.1(A) ; port MCU_PWM
NetU?#2_78: U?#9.15(~{CS}) ; port ADC_CS
NetU?#9_2: U?#9.2(CH0) ; port IN0_CONN
NetU?#9_3: U?#9.3(CH1) ; port IN1_CONN
NetU?#9_4: U?#9.4(CH2) ; port IN2_CONN
NetU?#9_5: U?#9.5(CH3) ; port IN3_CONN

Not connected (* = marked no-connect by the designer): U?#9 13(BUSY)

### Library data of the parts
C?#20 C?#21 = C0603C104K5RAC7411: as C?#10 on sheet communication; Supplier 1: Digi-Key; Manufacturer Part Number: C0603C104K5RAC7411; RoHS: Yes; Category: Ceramic Capacitors; Stock 1: 3300000; Pricing 1: 15000=0,01540, 30000=0,01463, 75000=0,01309, 105000=0,01059, 150000=0,01024, 375000=0,00963 (USD); Mount: Surface Mount; Case/Package: 0603; Case Code (Metric): 1608; Case Code (Imperial): 0603; Dielectric Material: Ceramic; Min Operating Temperature: -55°C; Max Operating Temperature: 125°C; Tolerance: 10%; Capacitance: 100nF; Dielectric: X7R; Voltage Rating (DC): 50V; Packaging: Tape and Reel; Package Quantity: 15000; Voltage Rating: 50V; Termination: SMD/SMT; Length: 1.6mm; Width: 0.031inch; Height: 0.8mm; Thickness: 0.035inch; Lead Pitch: 0.7mm; Depth: 0.8mm; Radiation Hardening: No; ComponentLink1URL: https://datasheet.ciiva.com/5424/kem-c1002-x7r-smd-5424426.pdf?src-supplier=Mouser; ComponentLink1Description: https://datasheet.ciiva.com/5424/kem-c1002-x7r-smd-5424426.pdf?src-supplier=Mouser; Supplier Part Number 1: 399-7374-2-ND
R?#19 = CRT0603-BY-1002EST: RESTHINFILM 0603 10K0 0.1% 100MW; Manufacturer: Bourns Inc.; Power (Watts): 0.1W, 1/10W; Temperature Coefficient: ±25ppm/°C; Part Number: CRT0603-BY-1002EST; Value: 10 kOhms; ComponentLink1Description: Datasheet; ComponentLink1URL: https://www.bourns.com/docs/Product-Datasheets/CRT-ST.pdf; ComponentLink2Description: DigiKey Link; ComponentLink2URL: http://digikey.com/product-detail/en/bourns-inc/CRT0603-BY-1002EST/CRT0603-BY-1002ESTCT-ND/7928091; Composition: Thin Film; Device Package: 0603 (1608 Metric); Features: Current Sense; Height - Seated (Max): 0.022" (0.55mm); LastUpdated: 20.05.2022 15:00:33; Lifecycle Status: Active; Minimum Order: 1; Number of Terminations: 2; Operating Temperature: -55°C ~ 155°C; Package / Case: 0603 (1608 Metric); Packaging: TapeAndReel; PartId: 23596; Part Status: Active; Price: 0.04; Resistance: 10 kOhms; Series: CRT-ST; Size / Dimension: 0.063" L x 0.031" W (1.60mm x 0.80mm); Supplier 1: DigiKey; Supplier Part Number 1: CRT0603-BY-1002ESTCT-ND; Supplier Device Package: 0603; Tolerance: ±0.1%
R?#20 = ERJ-3GEYJ221V: RES SMD 220 OHM 5% 1/10W 0603; Manufacturer: Panasonic Electronic Components; Power (Watts): 0.1W, 1/10W; Temperature Coefficient: ±200ppm/°C; Part Number: ERJ-3GEYJ221V; Value: 220 Ohms; ComponentLink1Description: Datasheet; ComponentLink1URL: http://industrial.panasonic.com/www-cgi/jvcr13pz.cgi?E+PZ+3+AOA0001+ERJ3GEYJ221V+7+WW; ComponentLink2Description: DigiKey Link; ComponentLink2URL: https://www.digikey.com/en/products/detail/panasonic-electronic-components/ERJ-3GEYJ221V/135719; Composition: Thick Film; Device Package: 0603 (1608 Metric); Features: Automotive AEC-Q200; Height - Seated (Max): 0.022" (0.55mm); LastUpdated: 20.05.2022 15:01:11; Lifecycle Status: Active; Minimum Order: 1; Number of Terminations: 2; Operating Temperature: -55°C ~ 155°C; Package / Case: 0603 (1608 Metric); Packaging: TapeAndReel; PartId: 12951; Part Status: Active; Price: 0.01; Ratings: AEC-Q200; Resistance: 220 Ohms; Series: ERJ-3G; Size / Dimension: 0.063" L x 0.031" W (1.60mm x 0.80mm); Supplier 1: DigiKey; Supplier Part Number 1: P220GCT-ND; Supplier Device Package: 0603; Tolerance: ±5%
U?#9 = ADS7841EB: Analogue to Digital Converter, 12 bit, 200 kSPS, Single, 2.7 V, 5.25 V, SSOP; MF: Texas Instruments; MP: ADS7841EB; SnapEDA_Link: https://www.snapeda.com/parts/ADS7841EB/Texas%20Instruments/view-part/559819/?ref=snap; Digi-Key_Purchase_URL: https://www.digikey.com/product-detail/en/texas-instruments/ADS7841EB-2K5/ADS7841EB-2K5-ND/300662?utm_source=snapeda&utm_medium=aggregator&utm_campaign=symbol; Value: *; Package: SSOP-16 Texas Instruments; Digi-Key_Part_Number: ADS7841EB/2K5-ND
U?#10 = U0032: Optoisolator Transistor with Base Output 5000Vrms 1 Channel 6-SMD; Manufacturer.: SHARP/Socle Technology; Part Number: PC81710NIP1B

## Nets that join several sheets
+3V3_ISO: communication (18 pins), USER_IO (6 pins)
+5V_ISO: communication (10 pins), USER_IO (R?#19.2)
GND: CPU (C?#2.2 C?#3.2 Y?.2 Y?.4), communication (20 pins), USER_IO (7 pins)
VIN_GND: CPU (13 pins), communication (C?#5.1 R?#17.1 R?#18.1 U?#4.5)
CAN_H: CPU (J?#4.1), communication (R?#16.2 U?#8.7)
CAN_L: CPU (J?#4.2), communication (R?#16.1 U?#8.6)
CONN_RX_UA: CPU (J?#5.1), communication (U?#4.6)
CONN_TX_UA: CPU (J?#5.2), communication (U?#4.8)
GPIO_RS485: CPU (U?#2.69), communication (U?#5.2 U?#5.3)
MCU_I2C_SCL: CPU (U?#2.84), communication (R?#5.1 U?#3.3)
MCU_I2C_SDA: CPU (U?#2.37), communication (R?#6.1 U?#3.2)
MCU_RX_485: CPU (U?#2.56), communication (R?#10.2 U?#6.4)
MCU_RX_CAN: CPU (U?#2.58), communication (U?#8.4)
MCU_RX_UA: CPU (U?#2.38), communication (U?#4.3)
MCU_TX_485: CPU (U?#2.42), communication (R?#9.1 U?#6.1)
MCU_TX_CAN: CPU (U?#2.60), communication (U?#8.1)
MCU_TX_UA: CPU (U?#2.40), communication (U?#4.1)
NetJ?#3_1: CPU (J?#3.1), communication (U?#7.14)
NetJ?#3_2: CPU (J?#3.2), communication (U?#7.13)
NetJ?#6_1: CPU (J?#6.1), communication (U?#7.7)
NetJ?#6_2: CPU (J?#6.2), communication (U?#7.8)
NetQ?#1_1: CPU (U?#2.26), communication (Q?#1.1)
NetQ?#2_1: CPU (U?#2.27), communication (Q?#2.1)
NetU?#2_41: CPU (U?#2.41), communication (U?#7.12)
NetU?#2_61: CPU (U?#2.61), USER_IO (U?#9.16)
NetU?#2_64: CPU (U?#2.64), USER_IO (U?#9.14)
NetU?#2_65: CPU (U?#2.65), USER_IO (U?#9.12)
NetU?#2_70: CPU (U?#2.70), USER_IO (U?#10.1)
NetU?#2_78: CPU (U?#2.78), USER_IO (U?#9.15)
NetU?#2_83: CPU (U?#2.83), communication (U?#7.10)
NetU?#2_85: CPU (U?#2.85), communication (U?#7.9)
NetU?#2_94: CPU (U?#2.94), communication (U?#7.11)